# EAGLE design Antenna (EAGLE 6.6.0)
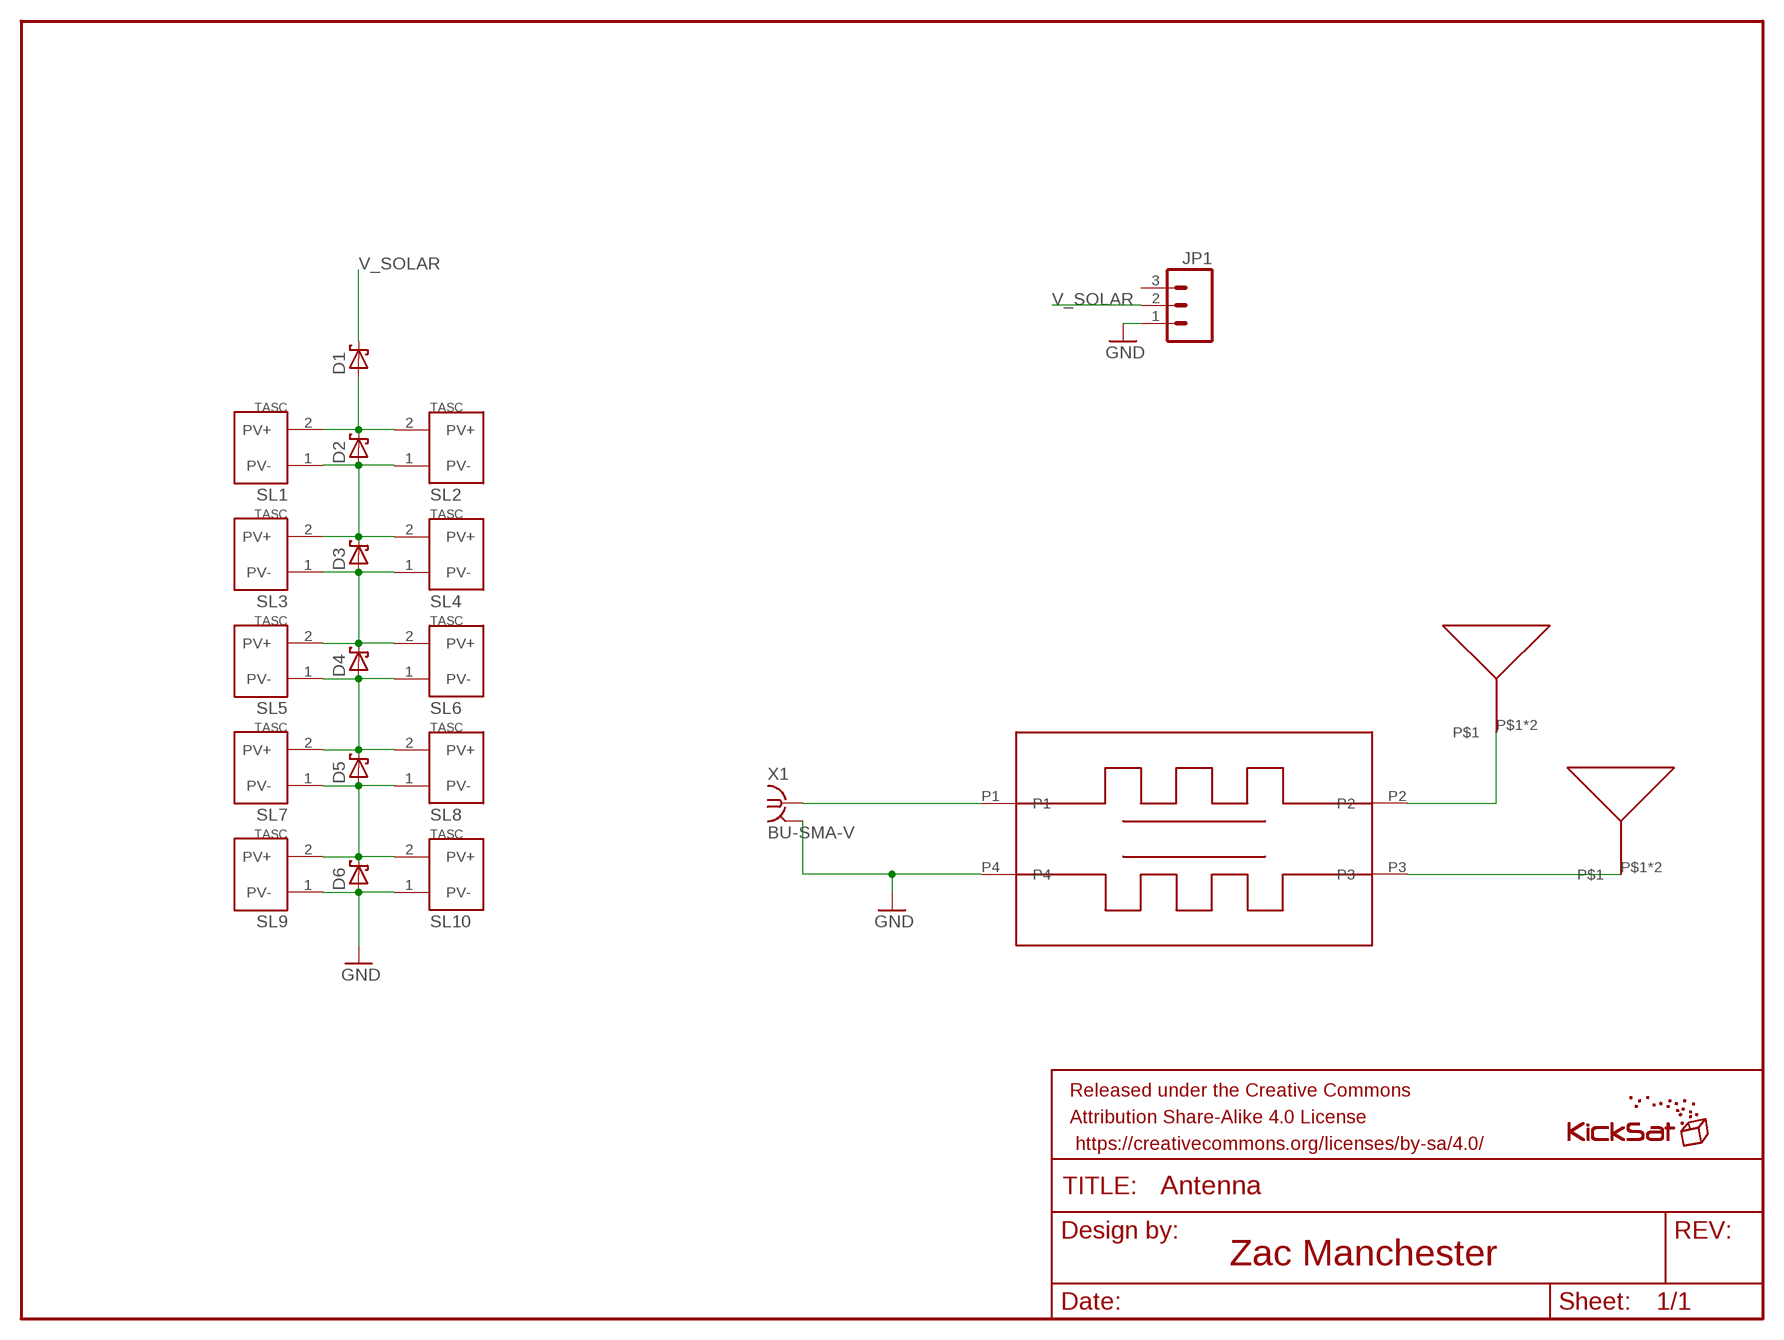
[diagram p0: schematic, sheet 1]

## Parts
B1  BALUN  [BALUN]
D1  SB_DIODE  [SB_DIODE]
D2  SB_DIODE  [SB_DIODE]
D3  SB_DIODE  [SB_DIODE]
D4  SB_DIODE  [SB_DIODE]
D5  SB_DIODE  [SB_DIODE]
D6  SB_DIODE  [SB_DIODE]
FRAME1  FRAME-LETTER  [CREATIVE_COMMONS]
JP1  M03POLAR_LOCK  [MOLEX-1X3_LOCK]
SL1  SOLAR_CELL  [SOLAR_CELL]
SL2  SOLAR_CELL  [SOLAR_CELL]
SL3  SOLAR_CELL  [SOLAR_CELL]
SL4  SOLAR_CELL  [SOLAR_CELL]
SL5  SOLAR_CELL  [SOLAR_CELL]
SL6  SOLAR_CELL  [SOLAR_CELL]
SL7  SOLAR_CELL  [SOLAR_CELL]
SL8  SOLAR_CELL  [SOLAR_CELL]
SL9  SOLAR_CELL  [SOLAR_CELL]
SL10  SOLAR_CELL  [SOLAR_CELL]
U$1  TAPEANTENNA  [TAPEANTENNA]
U$2  TAPEANTENNA  [TAPEANTENNA]
U$3  KICKSAT_LOGO  [KICKSAT_LOGO]
X1  BU-SMA-V  [BU-SMA-V]

## Nets
GND: B1.P4 D6.POS JP1.1 SL9.1(PV-) SL10.1(PV-) X1.2 X1.3 X1.4 X1.5
N$1: B1.P1 X1.1
N$9: D1.POS D2.NEG SL1.2(PV+) SL2.2(PV+)
N$37: D3.POS D4.NEG SL3.1(PV-) SL4.1(PV-) SL5.2(PV+) SL6.2(PV+)
N$39: D4.POS D5.NEG SL5.1(PV-) SL6.1(PV-) SL7.2(PV+) SL8.2(PV+)
N$45: D2.POS D3.NEG SL1.1(PV-) SL2.1(PV-) SL3.2(PV+) SL4.2(PV+)
N$50: D5.POS D6.NEG SL7.1(PV-) SL8.1(PV-) SL9.2(PV+) SL10.2(PV+)
RFN: B1.P2 U$1.P$1 U$1.P$2
RFP: B1.P3 U$2.P$1 U$2.P$2
V_SOLAR: D1.NEG JP1.2
Unconnected: JP1.3

## Notes on the sheet
- Zac Manchester

## Library data of the parts
B1 = Balun:BALUN
D1-D6 = Solar:SB_DIODE
FRAME1 = SparkFun-Aesthetics:FRAME-LETTER: Schematic Frame Standard 8.5x11 US Letter frame
JP1 = SparkFun-Connectors:M03: Header 3 Standard 3-pin 0.1" header. Use with straight break away headers (SKU : PRT-00116), right angle break away headers (PRT-00553), swiss pins (PRT-00743), machine pins (PRT-00117), and female headers (PRT-00115). Molex polarized connector foot print use with SKU : PRT-08232 with associated crimp pins and housings.
SL1-SL10 = Solar:SOLAR_CELL
U$1 U$2 = TapeAntenna:TAPEANTENNA
U$3 = KickSat-Logo:KICKSAT_LOGO
X1 = con-coax:BU-SMA-V: FEMALE SMA CONNECTOR Radiall distributor RS 112-3794; OC_FARNELL: unknown; OC_NEWARK: unknown

## Board
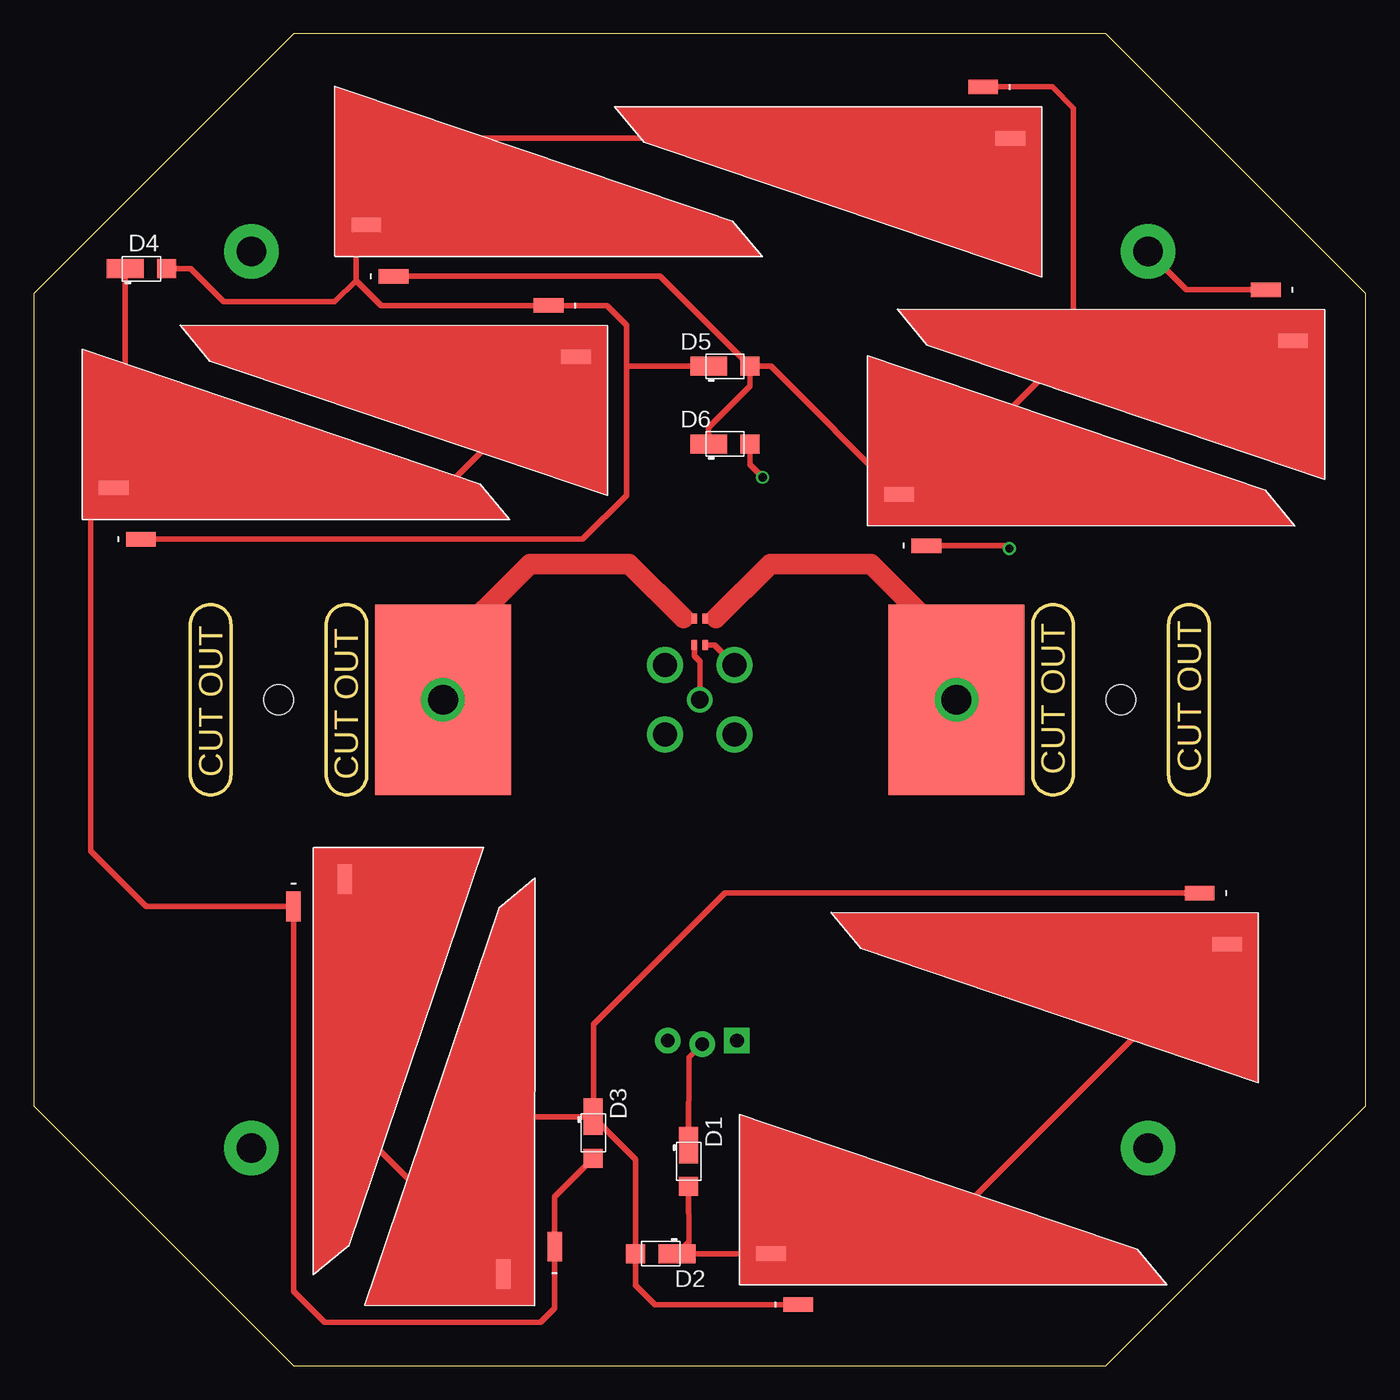
[diagram p1: board, top side]
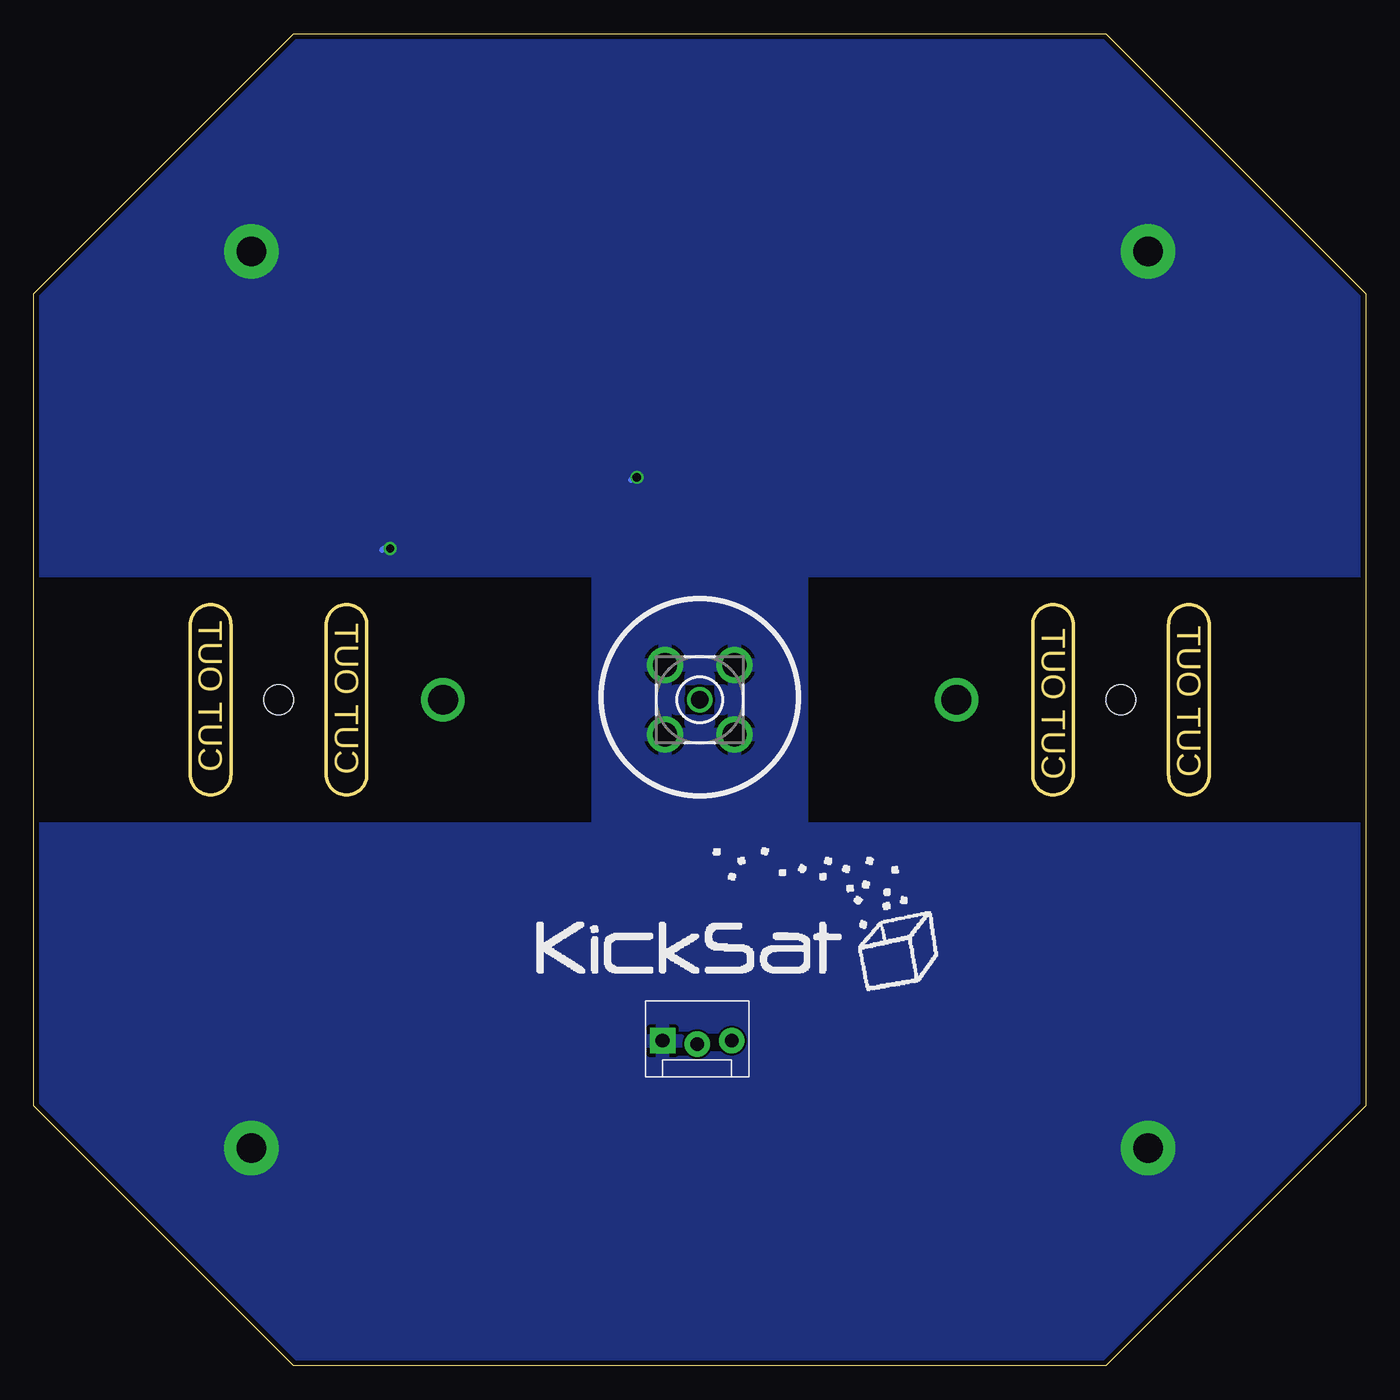
[diagram p2: board, bottom side, seen from below]

Size 98 x 98 mm. Coordinates in mm from the lower left corner, seen from the top.
Outline: 0,19.1 19.1,0 78.9,0 98,19.1 98,78.9 78.9,98 19.1,98 0,78.9 0,19.1
Outline: 76.5,54.5 76.5,43.5 arc-180 73.5,43.5 73.5,54.5 arc-180 76.5,54.5
Outline: 11.5,43.5 11.5,54.5 arc-180 14.5,54.5 14.5,43.5 arc-180 11.5,43.5
Outline: 21.5,43.5 21.5,54.5 arc-180 24.5,54.5 24.5,43.5 arc-180 21.5,43.5
Outline: 86.5,54.5 86.5,43.5 arc-180 83.5,43.5 83.5,54.5 arc-180 86.5,54.5
Copper layers (1*16): Top 0.0356mm / dielectric 1.5011mm / Bottom 0.0356mm
Design rules "OSHPark-2layer": minimum track width 6mil, minimum drill 13mil, track to track 6mil, track to pad 6mil, pad to pad 6mil, via to via 6mil, smd to smd 6mil, copper to edge 15mil, drill to drill 6mil, minimum pad ring 7mil, minimum via ring 7mil, stop-mask expansion 4mil, vias tented up to drill 0mil, thermal gap 10mil
Holes 2.2 mm at 18,49 80,49

### Footprints (pad centres in the part's own frame; a part is rotated, then mirrored left to right if it is on the bottom)
BALUN = smd 0.75 x 0.4: P1 -0.975,0.4; P2 0.975,0.4; P3 0.975,-0.4; P4 -0.975,-0.4
SB_DIODE = smd 2.7 x 1.4: NEG -1.2,0 | smd 1.4 x 1.4: POS 1.85,0
MOLEX-1X3_LOCK = drill 1.016 pad 1.88 square: 1 0,0.127 | drill 1.016 pad 1.88: 2 2.54,-0.127; 3 5.08,0.127
SOLAR_CELL = smd 1.067 x 2.184: 1 -1.589,2.999; 2 2.187,5.011
TAPEANTENNA = smd 10 x 14: P$1 0,0 | drill 2.2: P$2 0,0
BU-SMA-V = drill 1.27: 1 0,0 | drill 1.778: 2 -2.55,2.55; 3 2.55,2.55; 4 2.55,-2.55; 5 -2.55,-2.55

### Placement (x,y rotation side)
B1  49,54 90 top
D1  48.18,15.03 270 top
D2  46.13,8.24 180 top
D3  41.16,17.11 270 top
D4  7.91,80.72 0 top
D5  50.86,73.54 0 top
D6  50.86,67.83 0 top
FRAME1  0,0 0 top
JP1  51.73,23.78 0 bottom
SL1  59.25,6.07 90 top
SL2  82.79,33.19 270 top
SL3  36.73,11.75 180 top
SL4  20.69,30.79 0 top
SL5  34.88,76.42 270 top
SL6  10.88,62.4 90 top
SL7  66.85,92.51 270 top
SL8  29.47,81.75 90 top
SL9  87.66,77.59 270 top
SL10  68.68,61.93 90 top
U$1  30.1,49 0 top
U$2  67.9,49 0 top
U$3  61.48,27.35 0 bottom
X1  49,49 0 bottom

### Tracks (layer width: path | path; a pad name or v marks a point on that pad's centre or on a via)
GND  (via drill 0.6, 2.2 pad 4)
  Top 0.4: B1.P4 50.08,53.02 X1.2
  Top 0.406: SL9.1 84.82,79.18 v82,82 | SL10.1 71.57,60.34 v71.78,60.13 | D6.POS 52.71,66.29 v53.63,65.37
  Bottom 0.406: v71.78,60.13 72.25,60.13 72.38,60 | v53.63,65.37 53.85,65.37 54.06,65.16
  other vias: 16,82 16,16 82,16
  pour Bottom: 0,58.5 41.5,58.5 41.5,39.5 0,39.5 0,19.1 19.1,0 78.9,0 98,19.1 98,39.5 56.5,39.5 56.5,58.5 98,58.5 98,78.9 78.9,98 19.1,98 0,78.9
N$1
  Top 0.4: X1.1 49,51.82 48.61,52.21 B1.P1
N$9
  Top 0.406: SL1.2 67.49,9.26 67.49,10.69 SL2.2 | 56.27,8.28 SL1.2 | SL1.2 54.22,8.24 D2.NEG 48.2,9.11 D1.POS
N$37
  Top 0.406: D3.POS 38.32,12.42 SL3.1 38.33,4.21 37.29,3.17 21.4,3.17 19.1,5.47 SL4.1 8.26,33.79 4.19,37.86 4.19,62.91 SL6.2 | SL6.2 30.25,64.59 SL5.2 | SL6.2 6.71,64.59 D4.NEG
N$39
  Top 0.406: SL6.1 40.39,60.81 43.6,64.02 43.6,73.43 | 43.6,73.43 43.6,76.58 42.16,78.02 SL5.1 25.56,78.01 23.71,79.86 | 23.71,79.86 23.71,83.87 23.64,83.94 SL8.2 30.84,90.32 SL7.2 | D5.NEG 43.71,73.54 43.6,73.43 | D4.POS 11.52,80.72 13.95,78.29 22.14,78.29 23.71,79.86
N$45
  Top 0.406: SL4.2 22.88,18.4 28.61,12.67 | 28.61,12.67 SL3.2 | 40.6,18.31 D3.NEG 44.28,15.19 D2.POS 44.28,5.89 45.71,4.46 56.23,4.46 SL1.1 | 40.6,18.31 34.25,18.31 28.61,12.67 | SL2.1 50.85,34.78 41.18,25.11 41.18,18.89 40.6,18.31
N$50
  Top 0.406: SL8.1 46.09,80.16 D5.POS | SL7.1 74.95,94.1 76.5,92.55 76.5,75.61 76.27,75.38 76.87,75.38 | 76.87,75.38 92.65,75.38 SL9.2 | 76.87,75.38 65.61,64.12 SL10.2 54.25,73.54 D5.POS | D6.NEG 49.66,69.03 52.71,72.08 D5.POS
RFN
  Top 0.4: B1.P2 47.83,54.98 47.8,55
  Top 1.5: 47.8,55 43.8,59 36.5,59 30,52.5 U$1.P$2
RFP
  Top 0.4: B1.P3 50.17,54.98 50.2,55
  Top 1.5: 50.2,55 54.2,59 61.6,59 68,52.6 U$2.P$2
V_SOLAR
  Top 0.406: D1.NEG 48.2,22.66 JP1.2

### Text on the board
Dimension: CUT OUT | CUT OUT | CUT OUT | CUT OUT